# Altium schematic sheet Access_System_Bmduino.SchDoc
size A4; SheetNumber: 1; SheetTotal: 1
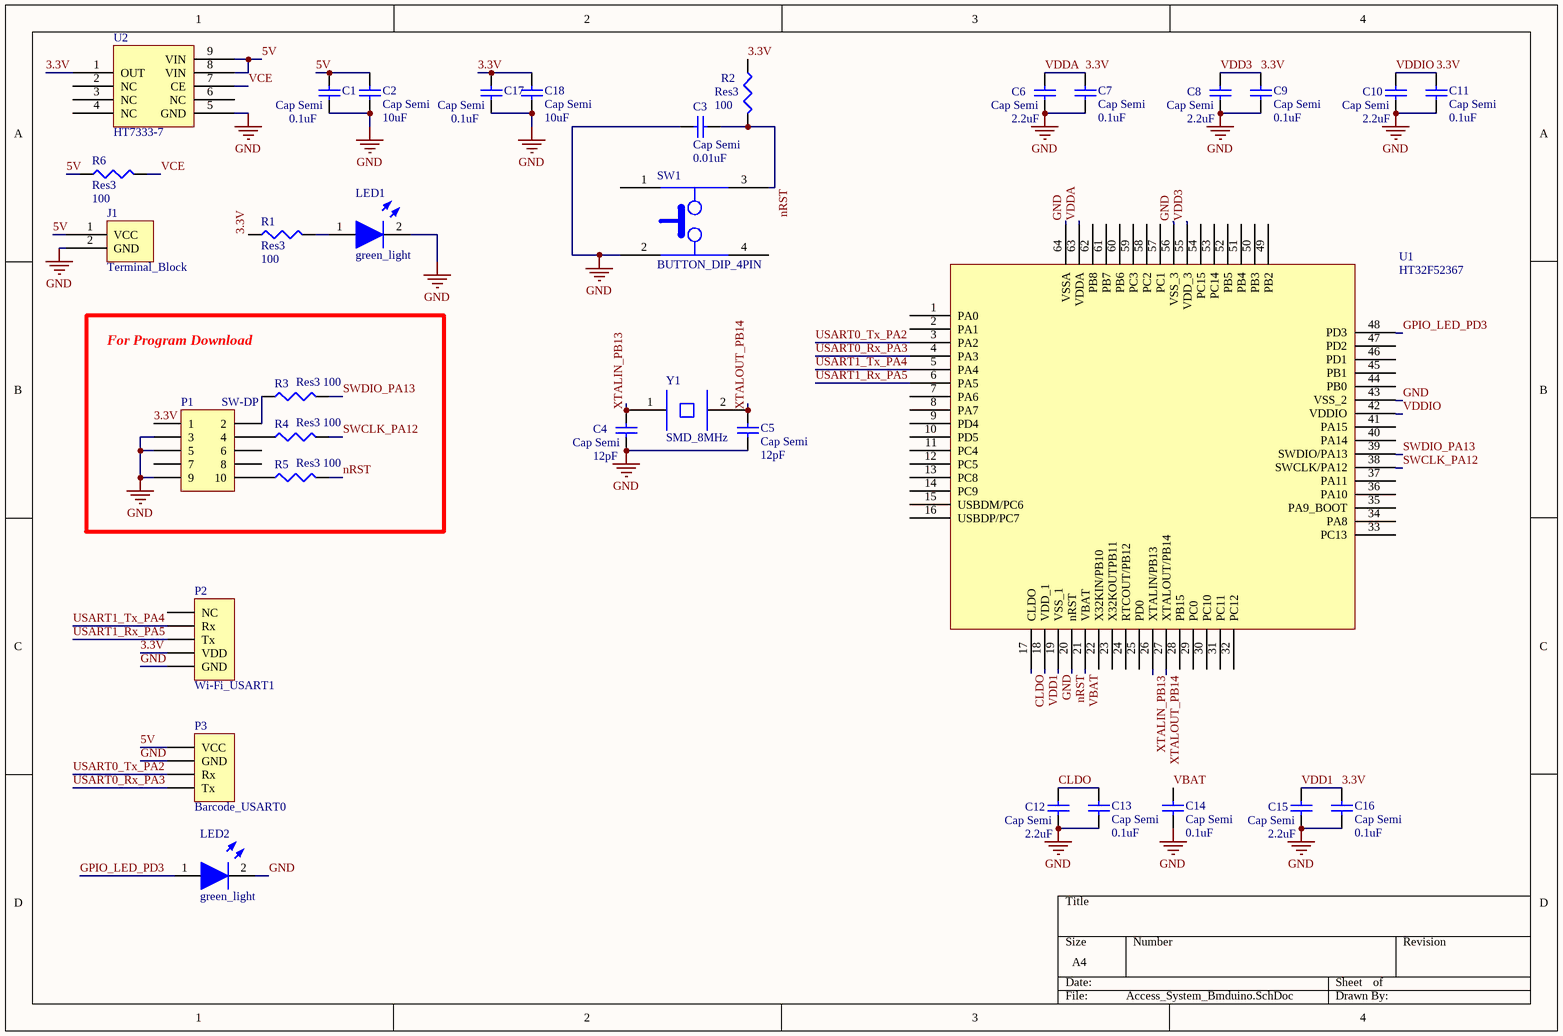
[diagram p0: Access_System_Bmduino.SchDoc]

## Parts
C1  Cap Semi  value 0.1uF  [1608[0603]]
C2  Cap Semi  value 10uF  [1608[0603]]
C3  Cap Semi  value 0.01uF  [1608[0603]]
C4  Cap Semi  value 12pF  [1608[0603]]
C5  Cap Semi  value 12pF  [1608[0603]]
C6  Cap Semi  value 2.2uF  [1608[0603]]
C7  Cap Semi  value 0.1uF  [1608[0603]]
C8  Cap Semi  value 2.2uF  [1608[0603]]
C9  Cap Semi  value 0.1uF  [1608[0603]]
C10  Cap Semi  value 2.2uF  [1608[0603]]
C11  Cap Semi  value 0.1uF  [1608[0603]]
C12  Cap Semi  value 2.2uF  [1608[0603]]
C13  Cap Semi  value 0.1uF  [1608[0603]]
C14  Cap Semi  value 0.1uF  [1608[0603]]
C15  Cap Semi  value 2.2uF  [1608[0603]]
C16  Cap Semi  value 0.1uF  [1608[0603]]
C17  Cap Semi  value 0.1uF  [1608[0603]]
C18  Cap Semi  value 10uF  [1608[0603]]
J1  Terminal_Block  [terminal block]
LED1  green_light  [LED_Green]
LED2  green_light  [LED_Green]
P1  SW-DP  [HDR2X5]
P2  Wi-Fi_USART1  [HDR1X5]
P3  Barcode_USART0  [HDR1X4]
R1  Res3  value 100  [J1-0603]
R2  Res3  value 100  [J1-0603]
R3  Res3  value 100  [J1-0603]
R4  Res3  value 100  [J1-0603]
R5  Res3  value 100  [J1-0603]
R6  Res3  value 100  [J1-0603]
SW1  BUTTON_DIP_4PIN  [Push_Button]
U1  HT32F52367  [HT32H52367]
U2  HT7333-7  [HT7333]
Y1  SMD_8MHz  [Quartz-Crystal-8MHz]

## Blocks framed on the sheet
For Program Download: P1 R3-R5

## Nets
GND: C1.1 C2.1 C3.2 C4.2 C5.1 C6.2 C7.1 C8.2 C9.1 C10.2 C11.1 C12.2 C13.1 C14.1 C15.2 C16.1 C17.1 C18.1 J1.2(GND) LED1.2 LED2.2 P1.3 P1.5 P1.9 P2.5(GND) P3.2(GND) SW1.2 U1.19(VSS_1) U1.43(VSS_2) U1.56(VSS_3) U1.64(VSSA) U2.5(GND)
3.3V: C6.1 C7.2 C8.1 C9.2 C10.1 C11.2 C15.1 C16.2 C17.2 C18.2 P1.1 P2.4(VDD) R1.1 R2.1 U1.18(VDD_1) U1.42(VDDIO) U1.55(VDD_3) U1.63(VDDA) U2.1(OUT)  [also labelled VDD1, VDD3, VDDA, VDDIO]
5V: C1.2 C2.2 J1.1(VCC) P3.1(VCC) R6.1 U2.8(VIN) U2.9(VIN)
CLDO: C12.1 C13.2 U1.17(CLDO)
GPIO_LED_PD3: LED2.1 U1.48(PD3)
nRST: C3.1 R2.2 R5.2 SW1.3 U1.20(nRST)
SWCLK_PA12: R4.2 U1.38(SWCLK/PA12)
SWDIO_PA13: R3.2 U1.39(SWDIO/PA13)
USART0_Rx_PA3: P3.4(Tx) U1.4(PA3)
USART0_Tx_PA2: P3.3(Rx) U1.3(PA2)
USART1_Rx_PA5: P2.3(Tx) U1.6(PA5)
USART1_Tx_PA4: P2.2(Rx) U1.5(PA4)
VBAT: C14.2 U1.21(VBAT)
VCE: R6.2 U2.7(CE)
XTALIN_PB13: C4.1 U1.26(XTALIN/PB13) Y1.1
XTALOUT_PB14: C5.2 U1.27(XTALOUT/PB14) Y1.2
NetLED1_1: LED1.1 R1.2
NetP1_2: P1.2 R3.1
NetP1_4: P1.4 R4.1
NetP1_10: P1.10 R5.1

Not connected (* = marked no-connect by the designer): P1 6 7 8; P2 1(NC); SW1 1 4; U1 1(PA0) 2(PA1) 7(PA6) 8(PA7) 9(PD4) 10(PD5) 11(PC4) 12(PC5) 13(PC8) 14(PC9) 15(USBDM/PC6) 16(USBDP/PC7) 22(X32KIN/PB10) 23(X32KOUTPB11) 24(RTCOUT/PB12) 25(PD0) 28(PB15) 29(PC0) 30(PC10) 31(PC11) 32(PC12) 33(PC13) 34(PA8) 35(PA9_BOOT) 36(PA10) 37(PA11) 40(PA14) 41(PA15) 44(PB0) 45(PB1) 46(PD1) 47(PD2) 49(PB2) 50(PB3) 51(PB4) 52(PB5) 53(PC14) 54(PC15) 57(PC1) 58(PC2) 59(PC3) 60(PB6) 61(PB7) 62(PB8); U2 2(NC) 3(NC) 4(NC) 6(NC)

## Library data of the parts
C1-C18 = Cap Semi: Capacitor (Semiconductor SIM Model); Published: 8-Jun-2000; LatestRevisionDate: 29-May-2009; LatestRevisionNote: IPC-7351 Footprint Added.; PackageReference: C1206; Publisher: Altium Limited; PackageDescription: Chip Capacitor
J1 = Terminal Block
LED1 LED2 = LED_Green
P1 = Header 5X2: Header, 5-Pin, Dual row; LatestRevisionDate: 17-Jul-2002; LatestRevisionNote: Re-released for DXP Platform.; Publisher: Altium Limited
P2 = Header 5: Header, 5-Pin; LatestRevisionDate: 17-Jul-2002; LatestRevisionNote: Re-released for DXP Platform.; Publisher: Altium Limited
P3 = Header 4: Header, 4-Pin; LatestRevisionDate: 17-Jul-2002; LatestRevisionNote: Re-released for DXP Platform.; Publisher: Altium Limited
R1-R6 = Res3: Resistor; Published: 8-Jun-2000; LatestRevisionDate: 29-May-2009; LatestRevisionNote: IPC-7351 Footprint Added.; PackageReference: J1-0603; Publisher: Altium Limited; PackageDescription: Chip Resistor
SW1 = Push_Button
U2 = HT7333
Y1 = Quartz_Crystal_8MHz